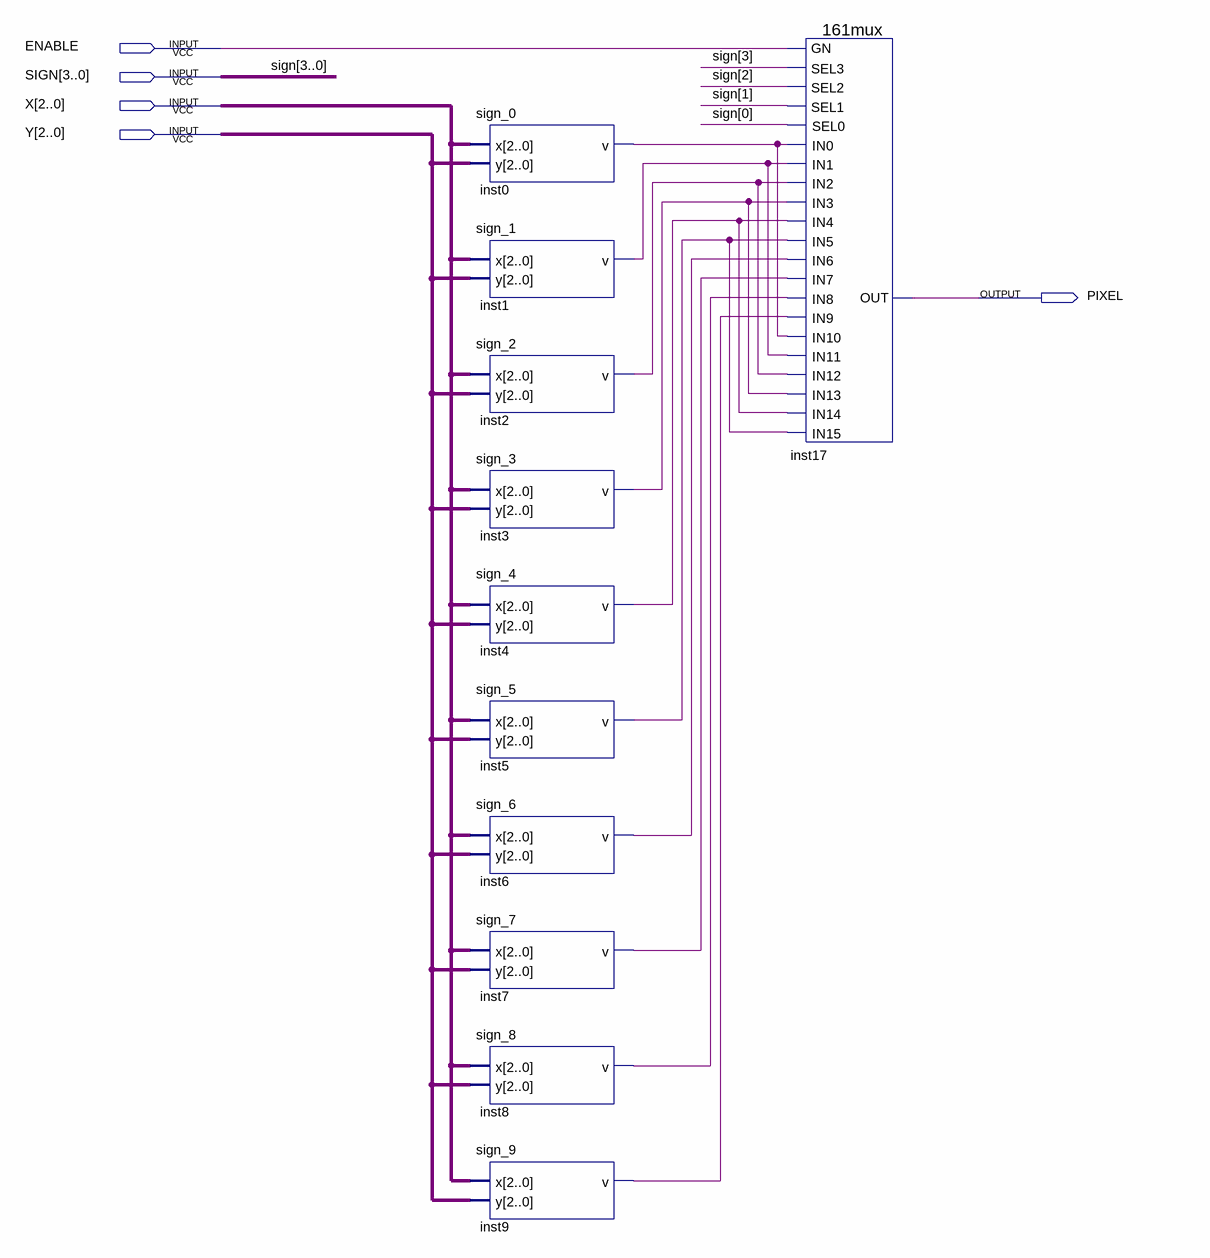
[diagram p0: schematic sheet]
// Quartus schematic SIGN_generator.bdf as structural Verilog: 11 symbols, 5 pins
module SIGN_generator (
  input  ENABLE,
  input  [3:0] SIGN,
  input  [2:0] X,
  input  [2:0] Y,
  output PIXEL
);

  wire inst0_v, inst1_v, inst2_v, inst3_v, inst4_v, inst5_v, inst6_v, inst7_v, inst8_v, inst9_v;

  sign_0 inst0 (.x(X), .y(Y), .v(inst0_v));
  sign_1 inst1 (.x(X), .y(Y), .v(inst1_v));
  sign_2 inst2 (.x(X), .y(Y), .v(inst2_v));
  sign_3 inst3 (.x(X), .y(Y), .v(inst3_v));
  sign_4 inst4 (.x(X), .y(Y), .v(inst4_v));
  sign_5 inst5 (.x(X), .y(Y), .v(inst5_v));
  sign_6 inst6 (.x(X), .y(Y), .v(inst6_v));
  sign_7 inst7 (.x(X), .y(Y), .v(inst7_v));
  sign_8 inst8 (.x(X), .y(Y), .v(inst8_v));
  sign_9 inst9 (.x(X), .y(Y), .v(inst9_v));
  \161mux  inst17 (
    .SEL3(SIGN[3]), .GN(ENABLE), .IN0(inst0_v), .SEL0(SIGN[0]), .SEL1(SIGN[1]), .SEL2(SIGN[2]),
    .IN3(inst3_v), .IN2(inst2_v), .IN1(inst1_v), .IN6(inst6_v), .IN5(inst5_v), .IN4(inst4_v), .IN9(inst9_v),
    .IN8(inst8_v), .IN7(inst7_v), .IN11(inst1_v), .IN12(inst2_v), .IN10(inst0_v), .IN15(inst5_v),
    .IN14(inst4_v), .IN13(inst3_v), .OUT(PIXEL));
endmodule
